# Altium schematic sheet usb.SchDoc
size A4
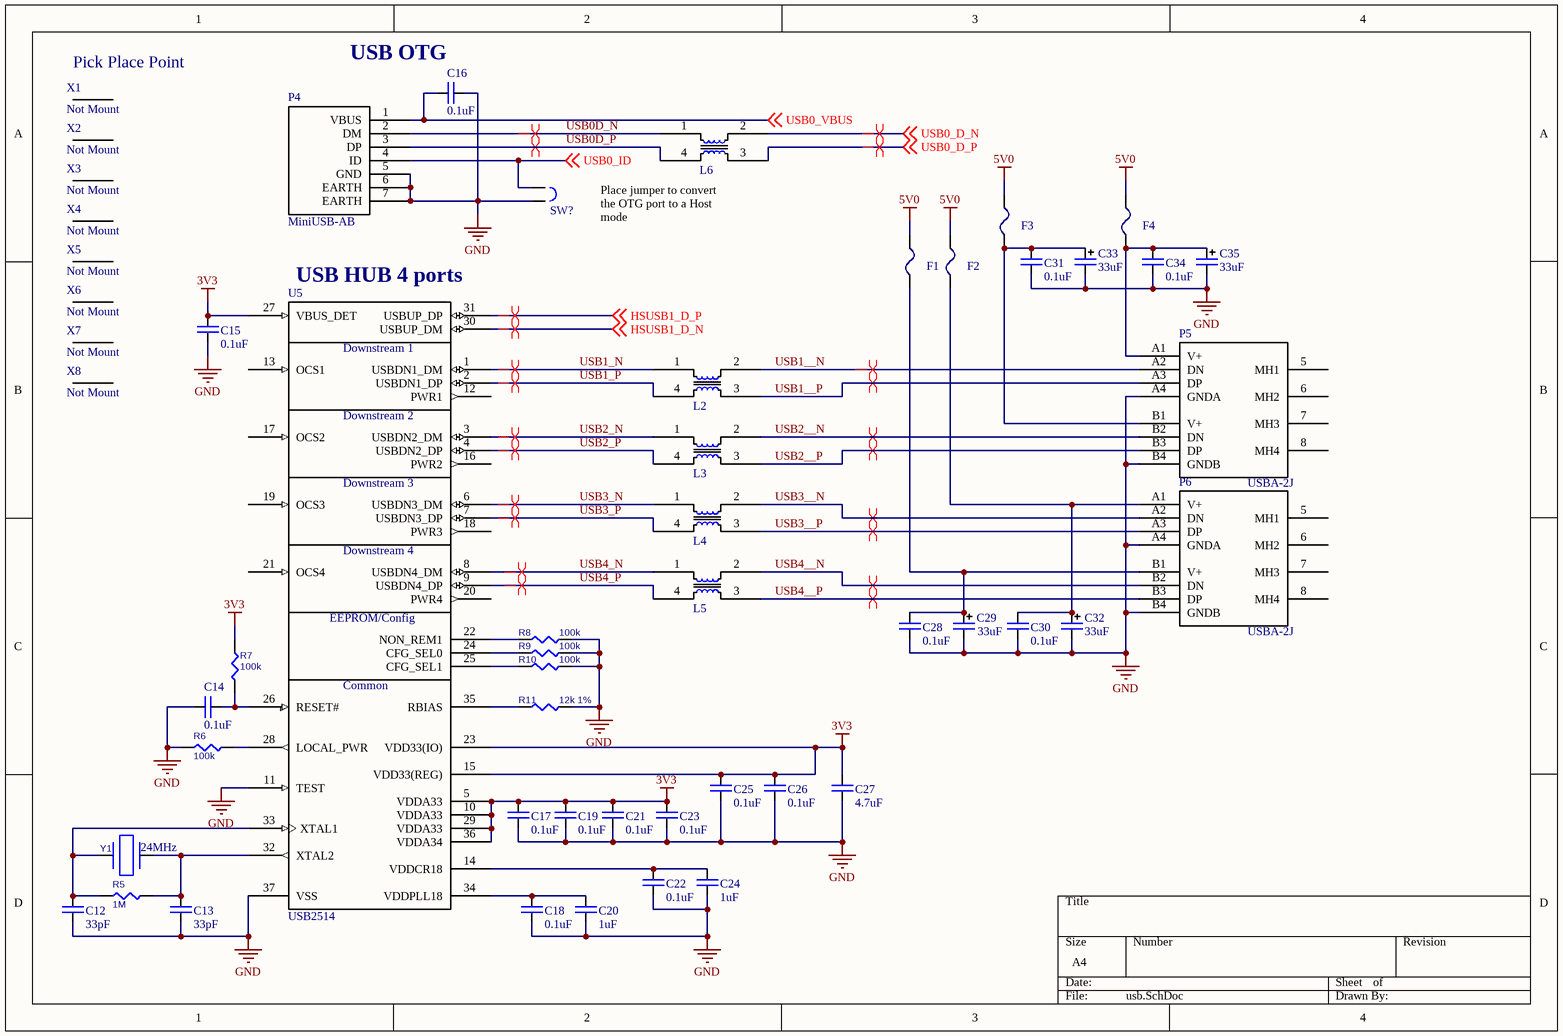
[diagram p0: usb.SchDoc]

## Parts
C12  value 33pF  [CHIP0603]  (hidden comment: C0603)
C13  value 33pF  [CHIP0603]  (hidden comment: C0603)
C14  value 0.1uF  [CHIP0603]  (hidden comment: C0603)
C15  value 0.1uF  [CHIP0603]  (hidden comment: C0603)
C16  value 0.1uF  [CHIP0603]  (hidden comment: C0603)
C17  value 0.1uF  [CHIP0603]  (hidden comment: C0603)
C18  value 0.1uF  [CHIP0603]  (hidden comment: C0603)
C19  value 0.1uF  [CHIP0603]  (hidden comment: C0603)
C20  value 1uF  [CHIP0603]  (hidden comment: C0603)
C21  value 0.1uF  [CHIP0603]  (hidden comment: C0603)
C22  value 0.1uF  [CHIP0603]  (hidden comment: C0603)
C23  value 0.1uF  [CHIP0603]  (hidden comment: C0603)
C24  value 1uF  [CHIP0603]  (hidden comment: C0603)
C25  value 0.1uF  [CHIP0603]  (hidden comment: C0603)
C26  value 0.1uF  [CHIP0603]  (hidden comment: C0603)
C27  value 4.7uF  [CHIP0603]  (hidden comment: C0603)
C28  value 0.1uF  [CHIP0603]  (hidden comment: C0603)
C29  value 33uF  [B]  (hidden comment: CAP B)
C30  value 0.1uF  [CHIP0603]  (hidden comment: C0603)
C31  value 0.1uF  [CHIP0603]  (hidden comment: C0603)
C32  value 33uF  [B]  (hidden comment: CAP B)
C33  value 33uF  [B]  (hidden comment: CAP B)
C34  value 0.1uF  [CHIP0603]  (hidden comment: C0603)
C35  value 33uF  [B]  (hidden comment: CAP B)
F1  MFU0603  [CHIP0603]  (value not drawn)
F2  MFU0603  [CHIP0603]  (value not drawn)
F3  MFU0603  [CHIP0603]  (value not drawn)
F4  MFU0603  [CHIP0603]  (value not drawn)
L2  DLW21H  [DLW21H]  (value not drawn)
L3  DLW21H  [DLW21H]  (value not drawn)
L4  DLW21H  [DLW21H]  (value not drawn)
L5  DLW21H  [DLW21H]  (value not drawn)
L6  DLW21H  [DLW21H]  (value not drawn)
P4  MiniUSB-AB  [MINI-USB-B5 SMT]
P5  USBA-2J  [USBA-2J]
P6  USBA-2J  [USBA-2J]
R5  value 1M  [CHIP0603]  (hidden comment: R0603)
R6  value 100k  [CHIP0603]  (hidden comment: R0603)
R7  value 100k  [CHIP0603]  (hidden comment: R0603)
R8  value 100k  [CHIP0603]  (hidden comment: R0603)
R9  value 100k  [CHIP0603]  (hidden comment: R0603)
R10  value 100k  [CHIP0603]  (hidden comment: R0603)
R11  value 12k 1%  [CHIP0603]  (hidden comment: R0603)
SW?  Jumper 2-pin  [JUMPER_2]  (value not drawn)
U5  USB2514  [QFN36]
X1  Not Mount  [POINT]
X2  Not Mount  [POINT]
X3  Not Mount  [POINT]
X4  Not Mount  [POINT]
X5  Not Mount  [POINT]
X6  Not Mount  [POINT]
X7  Not Mount  [POINT]
X8  Not Mount  [POINT]
Y1  value 24MHz  [HS49smd]  (hidden comment: Geyer KX-K 24.0)

## Nets
3V3: C15.2 C17.1 C19.1 C21.1 C23.1 C25.1 C26.1 C27.1 R7.2 U5.5(VDDA33) U5.10(VDDA33) U5.15(VDD33(REG)) U5.23(VDD33(IO)) U5.27(VBUS_DET) U5.29(VDDA33) U5.36(VDDA34)
5V0: F1.2 F2.2 F3.2 F4.2
GND: C12.2 C13.2 C14.1 C15.1 C16.2 C17.2 C18.2 C19.2 C20.2 C21.2 C22.2 C23.2 C24.2 C25.2 C26.2 C27.2 C28.2 C29.2 C30.2 C31.2 C32.2 C33.2 C34.2 C35.2 P4.5(GND) P4.6(EARTH) P4.7(EARTH) P5.A4(GNDA) P5.B4(GNDB) P6.A4(GNDA) P6.B4(GNDB) R6.2 R8.2 R9.2 R10.2 R11.2 SW?.2 U5.11(TEST) U5.37(VSS)
HSUSB1_D_N: U5.30(USBUP_DM) ; off-sheet HSUSB1_D_N
HSUSB1_D_P: U5.31(USBUP_DP) ; off-sheet HSUSB1_D_P
USB0_D_N: L6.2 ; off-sheet USB0_D_N
USB0_D_P: L6.3 ; off-sheet USB0_D_P
USB0_ID: P4.4(ID) SW?.1 ; off-sheet USB0_ID
USB0_VBUS: C16.1 P4.1(VBUS) ; off-sheet USB0_VBUS
USB0D_N: L6.1 P4.2(DM)
USB0D_P: L6.4 P4.3(DP)
USB1__N: L2.2 P5.A2(DN)
USB1__P: L2.3 P5.A3(DP)
USB1_N: L2.1 U5.1(USBDN1_DM)
USB1_P: L2.4 U5.2(USBDN1_DP)
USB2__N: L3.2 P5.B2(DN)
USB2__P: L3.3 P5.B3(DP)
USB2_N: L3.1 U5.3(USBDN2_DM)
USB2_P: L3.4 U5.4(USBDN2_DP)
USB3__N: L4.2 P6.A2(DN)
USB3__P: L4.3 P6.A3(DP)
USB3_N: L4.1 U5.6(USBDN3_DM)
USB3_P: L4.4 U5.7(USBDN3_DP)
USB4__N: L5.2 P6.B2(DN)
USB4__P: L5.3 P6.B3(DP)
USB4_N: L5.1 U5.8(USBDN4_DM)
USB4_P: L5.4 U5.9(USBDN4_DP)
NetC12_1: C12.1 R5.2 U5.33(XTAL1) Y1.1
NetC13_1: C13.1 R5.1 U5.32(XTAL2) Y1.2
NetC14_2: C14.2 R7.1 U5.26(RESET#)
NetC18_1: C18.1 C20.1 U5.34(VDDPLL18)
NetC22_1: C22.1 C24.1 U5.14(VDDCR18)
NetC28_1: C28.1 C29.1 F1.1 P6.B1(V+)
NetC30_1: C30.1 C32.1 F2.1 P6.A1(V+)
NetC31_1: C31.1 C33.1 F3.1 P5.B1(V+)
NetC34_1: C34.1 C35.1 F4.1 P5.A1(V+)
NetR6_1: R6.1 U5.28(LOCAL_PWR)
NetR8_1: R8.1 U5.22(NON_REM1)
NetR9_1: R9.1 U5.24(CFG_SEL0)
NetR10_1: R10.1 U5.25(CFG_SEL1)
NetR11_1: R11.1 U5.35(RBIAS)

Not connected (* = marked no-connect by the designer): P5 5(MH1) 6(MH2) 7(MH3) 8(MH4); P6 5(MH1) 6(MH2) 7(MH3) 8(MH4); U5 12(PWR1) 13(OCS1) 16(PWR2) 17(OCS2) 18(PWR3) 19(OCS3) 20(PWR4) 21(OCS4); X1 1; X2 1; X3 1; X4 1; X5 1; X6 1; X7 1; X8 1

## Layout directives
differential pair: HSUSB1_D_N, HSUSB1_D_P, USB0_D_N, USB0_D_P, USB0D_N, USB0D_P, USB1__N, USB1__P, USB1_N, USB1_P, USB2__N, USB2__P, USB2_N, USB2_P, USB3__N, USB3__P, USB3_N, USB3_P, USB4__N, USB4__P, USB4_N, USB4_P

## Notes on the sheet
- (near X1) Pick Place Point
- USB OTG
- (near L6) Place jumper to convert the OTG port to a Host mode
- (near U5) USB HUB 4 ports
- (in symbol USB2514) Downstream 1; Downstream 2; Downstream 3; Downstream 4; EEPROM/Config; Common

## Library data of the parts
C12-C28 C30 C31 C34 = C0603: Ceramic capacitor C0603
C29 C32 C33 C35 = CAP B: Tantalum capacitor. Case B
F1-F4 = MFU0603: Thin Film Fuse; Manufacturer: Vishay; Man P/N: MFU0603FF01500P100; Package: 0603
L2-L6 = DLW21H: Low profile wire-wound common choke coil; Manufacturer: Murata; Man P/N: DLW21HN900SQ2
P4 = MiniUSB-AB: Mini USB Type AB CONNECTOR
P5 P6 = USBA-2J: USB HOST Type A Double CONNECTOR; Vendor: brownbear.ru; Man P/N: USBA-2J
R5-R11 = R0603: Resistor 0603
SW? = Jumper 2-pin: Jumper 2-pin 2.54mm
U5 = USB2514: USB 2.0 High-Speed HUB controller; Manufacturer: SMSC; Man P/N: USB2514-AEZG; Package: 36QFN
X1-X8 = Point Pick: Pick Point
Y1 = KX-12B: Quartz crystal  SMD